# EAGLE design LM317-01 (EAGLE 5.05)
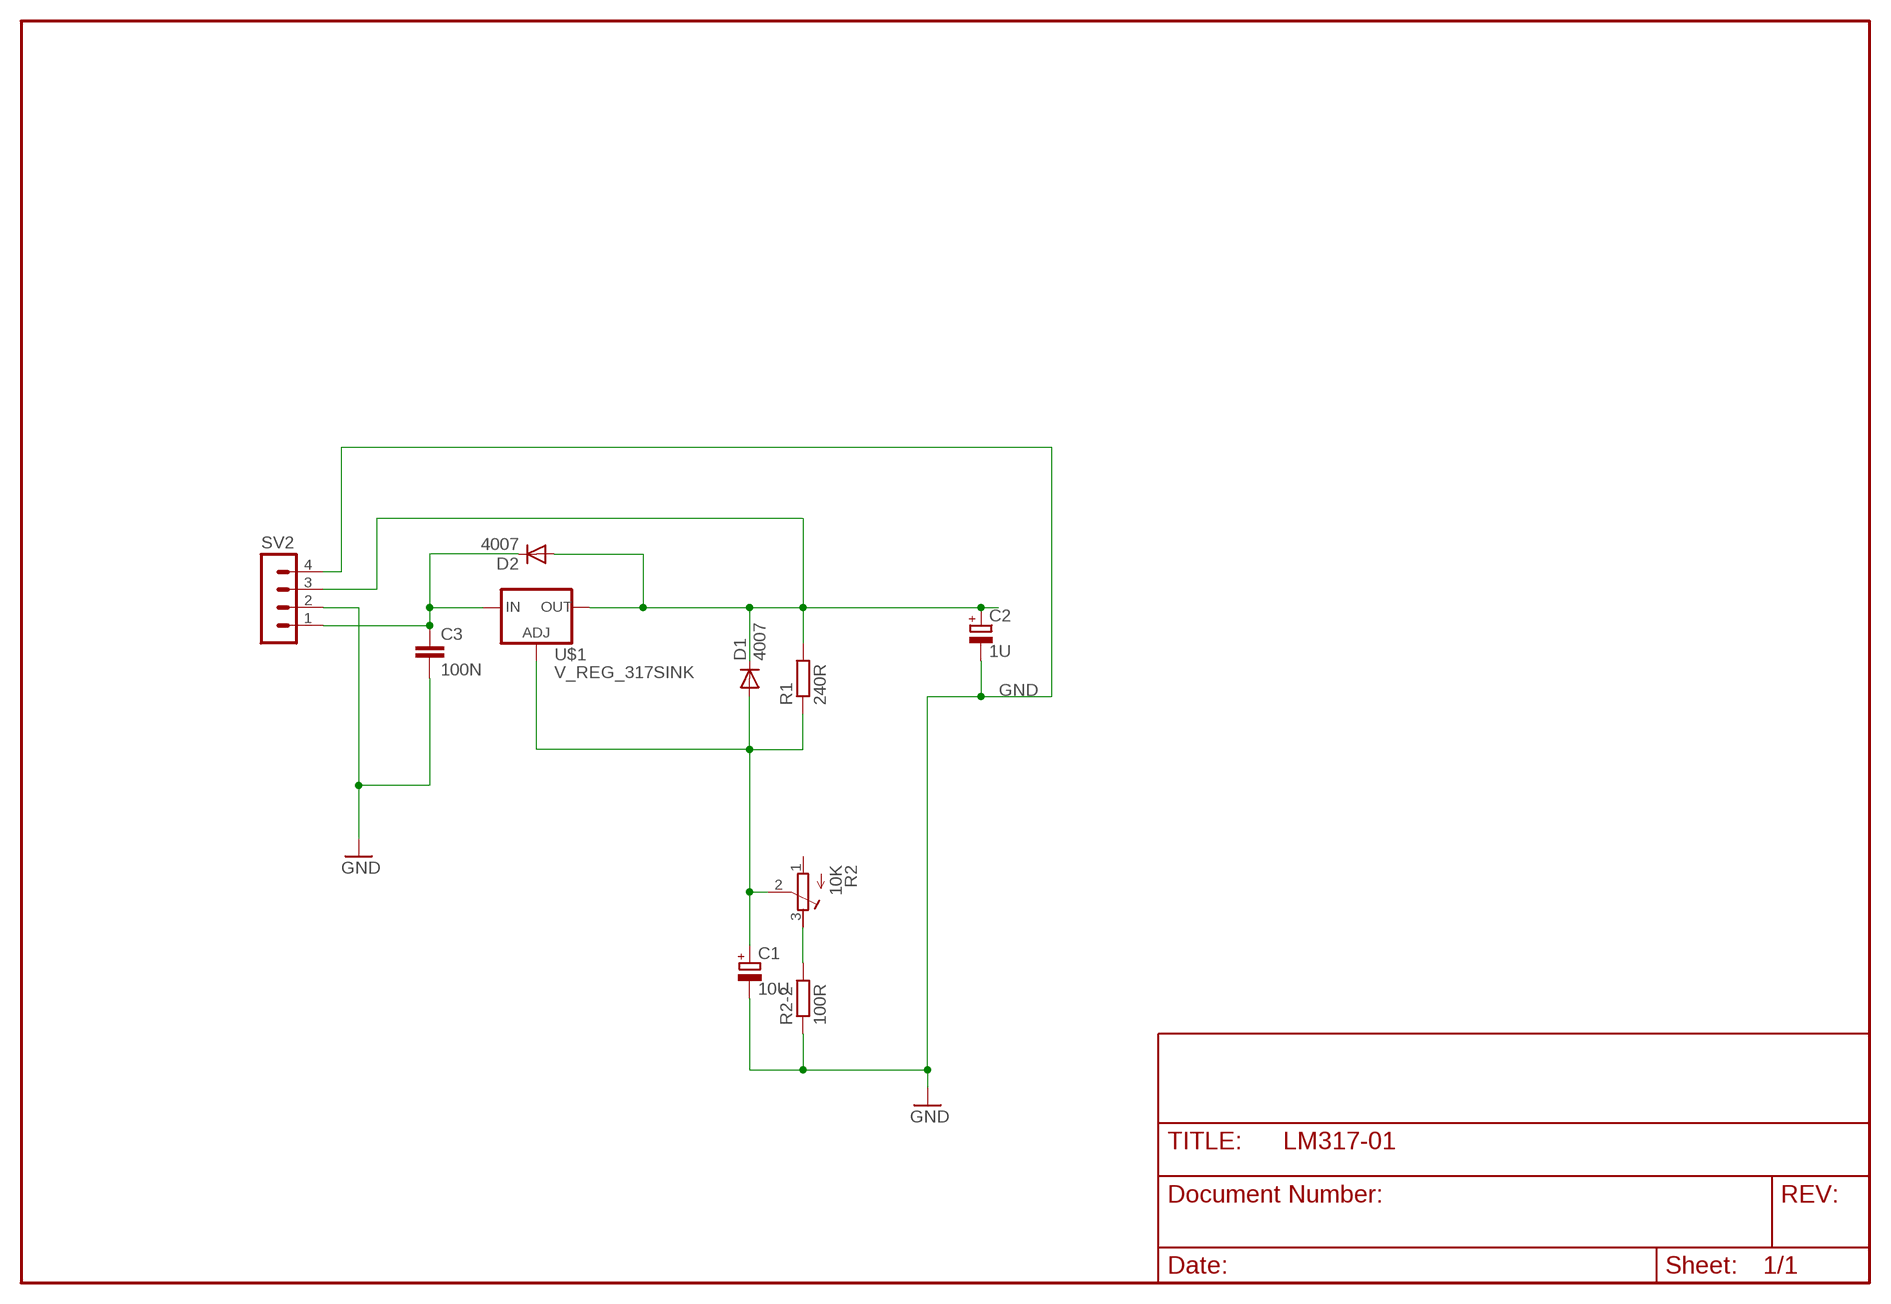
[diagram p0: schematic, sheet 1]

## Parts
C1  10U  CPOL-EUE2.5-5  [E2,5-5]
C2  1U  CPOL-EUE2.5-5  [E2,5-5]
C3  100N  C-EUC0805  [C0805]
D1  4007  CGRM4007-G  [SOD-123_MINI-SMA]
D2  4007  CGRM4007-G  [SOD-123_MINI-SMA]
R1  240R  R-EU_M0805  [M0805]
R2  10K  R-TRIMM64Y  [RTRIM64Y]
R2-2  100R  R-EU_M0805  [M0805]
SV2  MA04-1  [MA04-1]
U$1  V_REG_317SINK  [TO220-ADJ]

## Nets
GND: C1.- C2.- C3.2 R2-2.1 SV2.2 SV2.4
REG: C1.+ D1.A R1.1 R2.2(S) U$1.ADJ
REGDN: R2-2.2 R2.3(A)
VIN: C3.1 D2.C SV2.1 U$1.IN
VOUT: C2.+ D1.C D2.A R1.2 SV2.3 U$1.OUT
Unconnected: R2.1(E)

## Library data of the parts
C1 C2 = rcl:CPOL-EU: POLARIZED CAPACITOR, European symbol
C3 = turbod3:C-EU: CAPACITOR, European symbol
D1 D2 = diode:CGRM400*-G: Molded plasitc,JEDEC SOD-123/Mini SMA Source: Comchip CGRM4001-G.pdf
R1 R2-2 = turbod3:R-EU_: RESISTOR, European symbol
R2 = rcl:R-TRIMM: Trimm resistor
SV2 = con-lstb:MA04-1: PIN HEADER
U$1 = SparkFunEagle-6-6-07:V_REG_317: Voltage Regulator Standard LM317 adjustable voltage regulator. AOI (Adjust Output Input). Google 'LM317 Calculator' for easy to use app to get the two resistor values needed. 240/720 for 5V output. 240/390 for 3.3V output. Spark Fun Electronics SKU : COM-00527

## Board
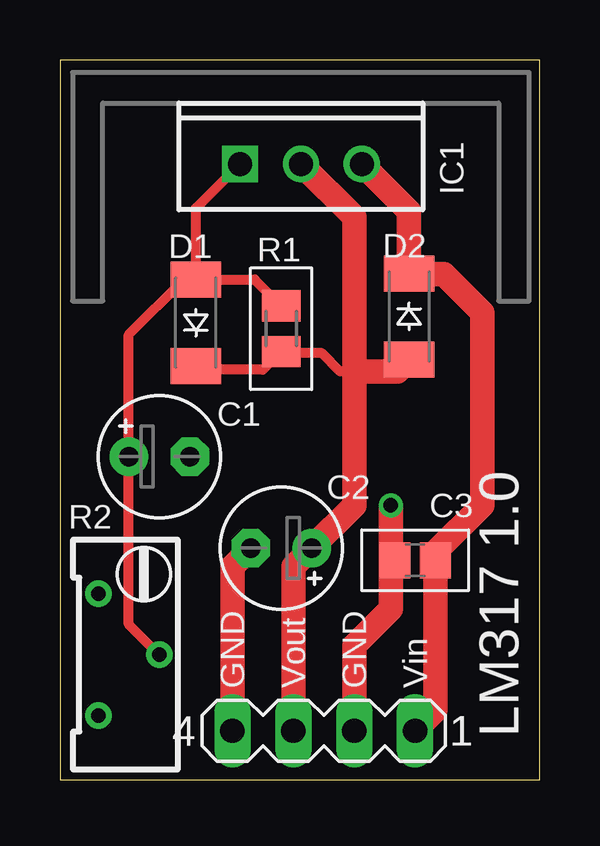
[diagram p1: board, top side]
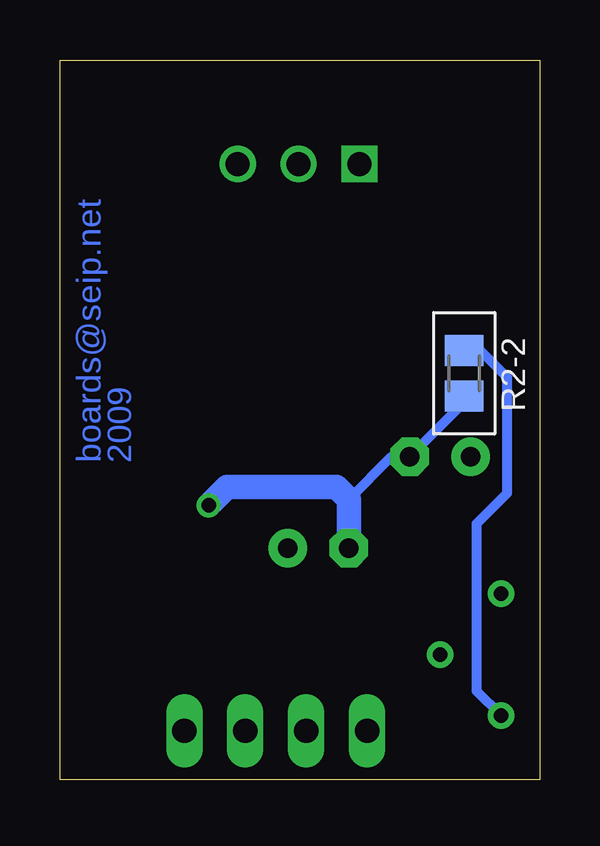
[diagram p2: board, bottom side, seen from below]

Size 20 x 30 mm. Coordinates in mm from the lower left corner, seen from the top.
Outline: 0,0 20,0 20,30 0,30 0,0
Copper layers (1*16): Top 0.035mm / dielectric 1.5mm / Bottom 0.035mm
Design rules "default": minimum track width 10mil, minimum drill 24mil, track to track 8mil, track to pad 8mil, pad to pad 8mil, via to via 8mil, smd to smd 8mil, copper to edge 40mil, drill to drill 8mil, minimum pad ring 10mil, minimum via ring 8mil, stop-mask expansion 4mil, vias tented up to drill 0mil, thermal gap 10mil

### Footprints (pad centres in the part's own frame; a part is rotated, then mirrored left to right if it is on the bottom)
E2,5-5 = drill 0.813 pad 1.6 round: + -1.27,0 | drill 0.813 pad 1.6 octagon: - 1.27,0
C0805 = smd 1.3 x 1.5: 1 -0.85,0; 2 0.85,0
SOD-123_MINI-SMA = smd 1.5 x 2.1: A 1.8,0; C -1.8,0
M0805 = smd 1.3 x 1.6: 1 -0.95,0; 2 0.95,0
RTRIM64Y = drill 0.61 round: 1 0,-2.54; 2 -2.54,0; 3 0,2.54
MA04-1 = drill 1.016 long: 1 -3.81,0; 2 -1.27,0; 3 1.27,0; 4 3.81,0
TO220-ADJ = drill 1 square: ADJ -2.54,0 | drill 1 round: IN 2.54,0; OUT 0,0

### Placement (x,y rotation side)
C1  4.14,13.46 0 top
C2  9.22,9.65 180 top
C3  14.81,9.14 180 top
D1  5.67,19.05 90 top
D2  14.56,19.3 270 top
R1  9.22,18.8 270 top
R2  1.6,5.21 180 top
R2-2  3.14,16.94 90 bottom
SV2  11,2.03 180 top
U$1  10.05,25.66 0 top

### Tracks (layer width: path | path; a pad name or v marks a point on that pad's centre or on a via)
GND  (via drill 0.6)
  Top 0.406: C2.- 7.95,10.16
  Top 1.016: SV2.2 12.27,5.59 13.8,7.11 13.8,8.98 C3.2 13.8,9.31 v13.8,11.43 | SV2.4 7.19,8.89 C2.-
  Bottom 0.406: R2-2.1 3.14,15.73 C1.- 6.18,13.46 7.95,11.68
  Bottom 1.016: C2.- 7.95,11.68 8.46,12.19 13.03,12.19 v13.8,11.43
  other vias: 7.95,9.65
REG
  Top 0.406: R2.2 2.87,6.48 C1.+ 2.87,18.54 5.18,20.85 D1.A | R1.1 8.12,20.85 6.35,20.85 D1.A | U$1.ADJ 5.67,23.83 D1.A
REGDN
  Bottom 0.406: R2.3 2.62,3.68 2.62,10.67 1.35,11.94 1.35,16.76 2.47,17.89 R2-2.2
VIN
  Top 1.016: SV2.1 15.66,2.88 C3.1 15.66,9.49 17.61,11.43 17.61,18.54 17.61,19.48 16,21.08 14.58,21.08 D2.C 14.56,23.69 U$1.IN
VOUT
  Top 0.406: D1.C 6.52,17.08 8.46,17.08 R1.2 9.29,17.78 10.92,17.78 11.68,17.02 12.27,17.02
  Top 1.016: 12.27,17.02 12.27,19.81 12.27,23.44 U$1.OUT | SV2.3 9.73,8.89 C2.+ 12.27,11.43 12.27,17.02 | 12.27,17.02 14.07,17.02 D2.A

### Text on the board
Bottom: 2009 | boards@seip.net
tNames: IC1 | GND | Vout | GND | Vin | LM317 1.0